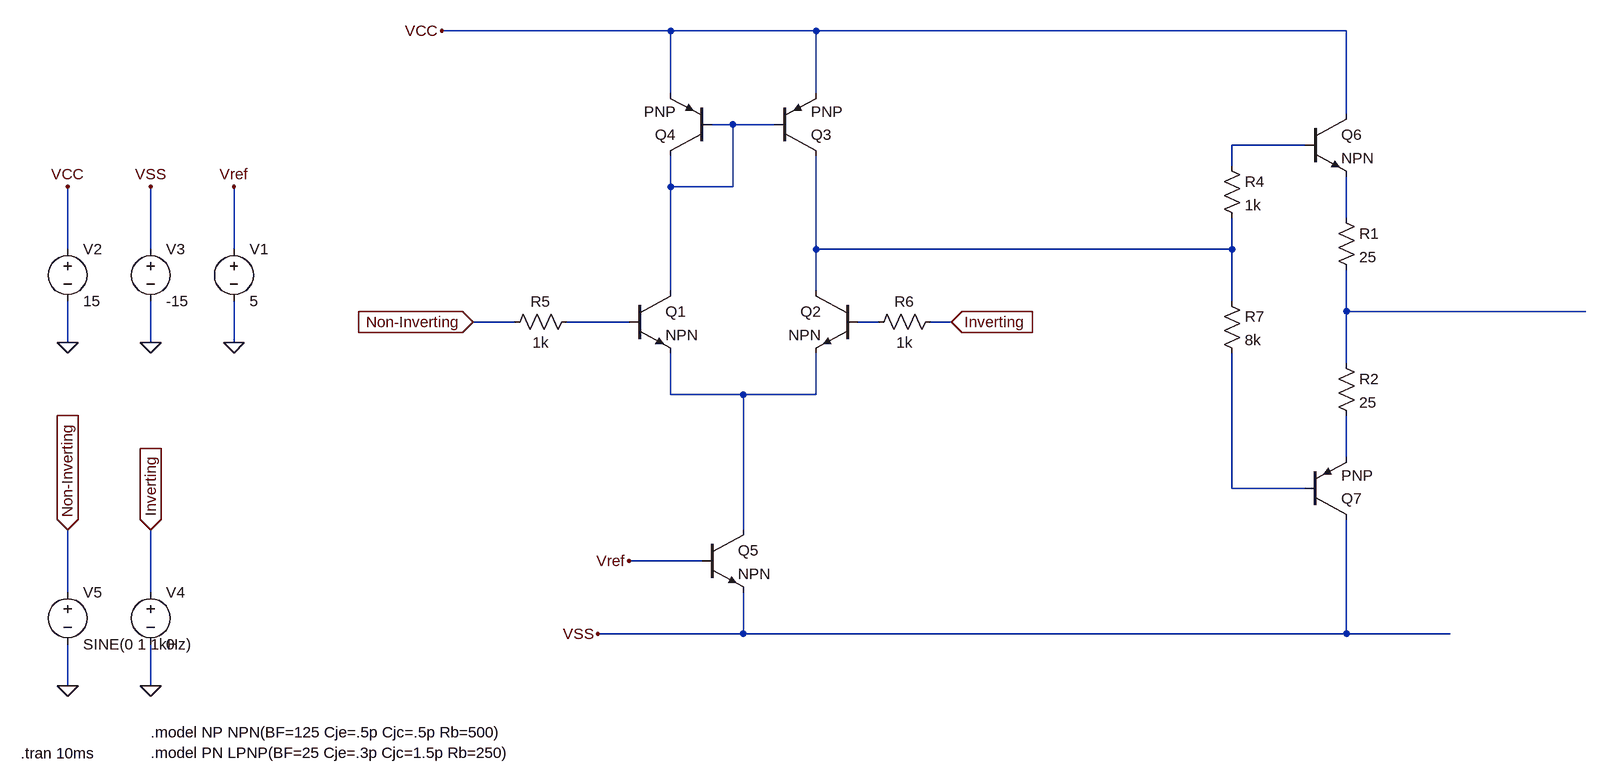
[diagram p0: schematic m_Opamp_VLSI.asc]
m_Opamp_VLSI.asc, the LTspice schematic file:
Version 4
SHEET 1 880 868
WIRE -1472 -544 -1824 -544
WIRE -1248 -544 -1472 -544
WIRE -432 -544 -1248 -544
WIRE -1472 -448 -1472 -544
WIRE -1248 -448 -1248 -544
WIRE -432 -416 -432 -544
WIRE -1376 -400 -1408 -400
WIRE -1312 -400 -1376 -400
WIRE -496 -368 -608 -368
WIRE -608 -336 -608 -368
WIRE -1472 -304 -1472 -352
WIRE -1376 -304 -1376 -400
WIRE -1376 -304 -1472 -304
WIRE -432 -256 -432 -320
WIRE -2400 -208 -2400 -304
WIRE -2272 -208 -2272 -304
WIRE -2144 -208 -2144 -304
WIRE -1248 -208 -1248 -352
WIRE -608 -208 -608 -256
WIRE -608 -208 -1248 -208
WIRE -1472 -144 -1472 -304
WIRE -1248 -144 -1248 -208
WIRE -608 -128 -608 -208
WIRE -432 -112 -432 -176
WIRE -64 -112 -432 -112
WIRE -1712 -96 -1776 -96
WIRE -1536 -96 -1632 -96
WIRE -1152 -96 -1184 -96
WIRE -1040 -96 -1072 -96
WIRE -2400 -64 -2400 -128
WIRE -2272 -64 -2272 -128
WIRE -2144 -64 -2144 -128
WIRE -432 -32 -432 -112
WIRE -1472 16 -1472 -48
WIRE -1360 16 -1472 16
WIRE -1248 16 -1248 -48
WIRE -1248 16 -1360 16
WIRE -432 112 -432 48
WIRE -608 160 -608 -48
WIRE -496 160 -608 160
WIRE -1360 224 -1360 16
WIRE -1424 272 -1536 272
WIRE -2400 320 -2400 224
WIRE -2272 320 -2272 224
WIRE -1360 384 -1360 320
WIRE -1360 384 -1584 384
WIRE -432 384 -432 208
WIRE -432 384 -1360 384
WIRE -272 384 -432 384
WIRE -2400 464 -2400 400
WIRE -2272 464 -2272 400
FLAG -1776 -96 Non-Inverting
IOPIN -1776 -96 In
FLAG -1040 -96 Inverting
IOPIN -1040 -96 In
FLAG -2144 -64 0
FLAG -2144 -304 Vref
FLAG -1536 272 Vref
FLAG -2272 -64 0
FLAG -2400 -64 0
FLAG -2400 -304 VCC
FLAG -2272 -304 VSS
FLAG -1824 -544 VCC
FLAG -2272 464 0
FLAG -2400 464 0
FLAG -2400 224 Non-Inverting
IOPIN -2400 224 In
FLAG -2272 224 Inverting
IOPIN -2272 224 In
FLAG -1584 384 VSS
SYMBOL npn -1536 -144 R0
SYMATTR InstName Q1
SYMBOL npn -1184 -144 M0
SYMATTR InstName Q2
SYMBOL pnp -1312 -352 M180
SYMATTR InstName Q3
SYMBOL pnp -1408 -352 R180
SYMATTR InstName Q4
SYMBOL npn -1424 224 R0
SYMATTR InstName Q5
SYMBOL voltage -2144 -224 R0
SYMATTR InstName V1
SYMATTR Value 5
SYMBOL voltage -2400 -224 R0
SYMATTR InstName V2
SYMATTR Value 15
SYMBOL voltage -2272 -224 R0
WINDOW 123 0 0 Left 0
WINDOW 39 0 0 Left 0
SYMATTR InstName V3
SYMATTR Value -15
SYMBOL npn -496 -416 R0
SYMATTR InstName Q6
SYMBOL voltage -2272 304 R0
SYMATTR InstName V4
SYMATTR Value 0
SYMBOL voltage -2400 304 R0
WINDOW 123 0 0 Left 0
WINDOW 39 0 0 Left 0
SYMATTR InstName V5
SYMATTR Value SINE(0 1 1kHz)
SYMBOL pnp -496 208 M180
SYMATTR InstName Q7
SYMBOL res -448 -272 R0
SYMATTR InstName R1
SYMATTR Value 25
SYMBOL res -448 -48 R0
SYMATTR InstName R2
SYMATTR Value 25
SYMBOL res -1616 -112 R90
WINDOW 0 0 56 VBottom 2
WINDOW 3 32 56 VTop 2
SYMATTR InstName R5
SYMATTR Value 1k
SYMBOL res -1056 -112 R90
WINDOW 0 0 56 VBottom 2
WINDOW 3 32 56 VTop 2
SYMATTR InstName R6
SYMATTR Value 1k
SYMBOL res -624 -352 R0
SYMATTR InstName R4
SYMATTR Value 1k
SYMBOL res -624 -144 R0
SYMATTR InstName R7
SYMATTR Value 8k
TEXT -2272 536 Left 2 !.model NP NPN(BF=125 Cje=.5p Cjc=.5p Rb=500)\n.model PN LPNP(BF=25 Cje=.3p Cjc=1.5p Rb=250)
TEXT -2472 568 Left 2 !.tran 10ms

The netlist it stands for:
* m_Opamp_VLSI.asc
Q1 N001 N006 N008 0 NPN
Q2 N004 N007 N008 0 NPN
Q3 N004 N001 VCC 0 PNP
Q4 N001 N001 VCC 0 PNP
Q5 N008 Vref VSS 0 NPN
V1 Vref 0 5
V2 VCC 0 15
V3 VSS 0 -15
Q6 VCC N002 N003 0 NPN
V4 Inverting 0 0
V5 Non-Inverting 0 SINE(0 1 1kHz)
Q7 VSS N010 N009 0 PNP
R1 N003 N005 25
R2 N005 N009 25
R5 N006 Non-Inverting 1k
R6 Inverting N007 1k
R4 N002 N004 1k
R7 N004 N010 8k
.model NPN NPN
.model PNP PNP
.lib standard.bjt
.model NP NPN(BF=125 Cje=.5p Cjc=.5p Rb=500)
.model PN LPNP(BF=25 Cje=.3p Cjc=1.5p Rb=250)
.tran 10ms
.backanno
.end